# Altium schematic sheet APP_1_Ethernet_m.SchDoc
size Tabloid; SheetNumber: 11; SheetTotal: 16; Sheet_Name: Ethernet; Size: 11x17
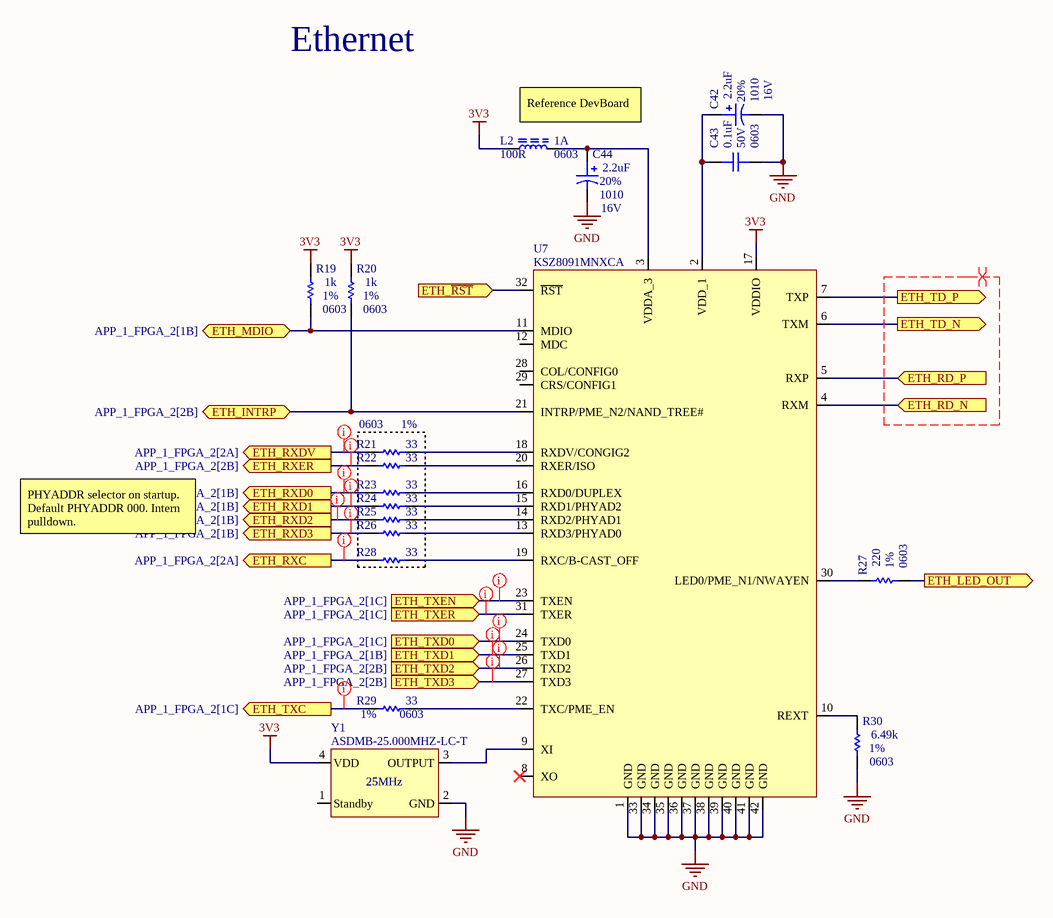
[diagram p0: APP_1_Ethernet_m.SchDoc]

## Parts
C42  value 2.2uF  Voltage: 16V  Package: 1010  Precision: 20%  [CAP_ALU_1010_vishay]  (hidden comment: MAL214699501E3)
C43  value 0.1uF  Voltage: 50V  Package: 0603  [CAP_0603]  (hidden comment: CAP - 0603)
C44  value 2.2uF  Voltage: 16V  Package: 1010  Precision: 20%  [CAP_ALU_1010_vishay]  (hidden comment: MAL214699501E3)
L2  value 100R  Current: 1A  Package: 0603  [FER_0603]  (hidden comment: FER - 0603)
R19  value 1k  Package: 0603  Precision: 1%  [RES_0603]  (hidden comment: RES - 0603)
R20  value 1k  Package: 0603  Precision: 1%  [RES_0603]  (hidden comment: RES - 0603)
R21  value 33  Package: 0603  Precision: 1%  [RES_0603]  (hidden comment: RES - 0603)
R22  value 33  [RES_0603]  (hidden comment: RES - 0603)
R23  value 33  [RES_0603]  (hidden comment: RES - 0603)
R24  value 33  [RES_0603]  (hidden comment: RES - 0603)
R25  value 33  [RES_0603]  (hidden comment: RES - 0603)
R26  value 33  [RES_0603]  (hidden comment: RES - 0603)
R27  value 220  Package: 0603  Precision: 1%  [RES_0603]  (hidden comment: RES - 0603)
R28  value 33  [RES_0603]  (hidden comment: RES - 0603)
R29  value 33  Package: 0603  Precision: 1%  [RES_0603]  (hidden comment: RES - 0603)
R30  value 6.49k  Package: 0603  Precision: 1%  [RES_0603]  (hidden comment: RES - 0603)
U7  KSZ8091MNXCA  [COM_ETH_PHY_KSZ8091MNXCA]
Y1  ASDMB-25.000MHZ-LC-T  [OSC_ASDMB-25.000MHZ-LC-T]

## Ports
ETH_INTRP (bidir, see APP_1_FPGA_2[2B]), ETH_LED_OUT (out), ETH_MDIO (bidir, see APP_1_FPGA_2[1B]), ETH_RD_N (in, see APP_1_Connectors_m[6B]), ETH_RD_P (in, see APP_1_Connectors_m[6B]), ETH_RXC (out, see APP_1_FPGA_2[2A]), ETH_RXD0 (out, see APP_1_FPGA_2[1B]), ETH_RXD1 (out, see APP_1_FPGA_2[1B]), ETH_RXD2 (out, see APP_1_FPGA_2[1B]), ETH_RXD3 (out, see APP_1_FPGA_2[1B]), ETH_RXDV (out, see APP_1_FPGA_2[2A]), ETH_RXER (out, see APP_1_FPGA_2[2B]), ETH_TD_N (out, see APP_1_Connectors_m[6B]), ETH_TD_P (out, see APP_1_Connectors_m[6B]), ETH_TXC (out, see APP_1_FPGA_2[1C]), ETH_TXD0 (in, see APP_1_FPGA_2[1C]), ETH_TXD1 (in, see APP_1_FPGA_2[1B]), ETH_TXD2 (in, see APP_1_FPGA_2[2B]), ETH_TXD3 (in, see APP_1_FPGA_2[2B]), ETH_TXEN (in, see APP_1_FPGA_2[1C]), ETH_TXER (in, see APP_1_FPGA_2[1C]), ETH_~{RST} (in)

## Nets
3V3: L2.2 R19.2 R20.2 U7.17(VDDIO) Y1.4(VDD)
GND: C42.2 C43.1 C44.2 R30.1 U7.1(GND) U7.33(GND) U7.34(GND) U7.35(GND) U7.36(GND) U7.37(GND) U7.38(GND) U7.39(GND) U7.40(GND) U7.41(GND) U7.42(GND) Y1.2(GND)
ETH_INTRP: R20.1 U7.21(INTRP/PME_N2/NAND_TREE#) ; port ETH_INTRP
ETH_LED_OUT: R27.1 ; port ETH_LED_OUT
ETH_MDIO: R19.1 U7.11(MDIO) ; port ETH_MDIO
ETH_~{RST}: U7.32(~{RST}) ; port ETH_~{RST}
ETH_RD_N: U7.4(RXM) ; port ETH_RD_N
ETH_RD_P: U7.5(RXP) ; port ETH_RD_P
ETH_RXC: R28.2 ; port ETH_RXC
ETH_RXD0: R23.2 ; port ETH_RXD0
ETH_RXD1: R24.2 ; port ETH_RXD1
ETH_RXD2: R25.2 ; port ETH_RXD2
ETH_RXD3: R26.2 ; port ETH_RXD3
ETH_RXDV: R21.2 ; port ETH_RXDV
ETH_RXER: R22.2 ; port ETH_RXER
ETH_TD_N: U7.6(TXM) ; port ETH_TD_N
ETH_TD_P: U7.7(TXP) ; port ETH_TD_P
ETH_TXC: R29.2 ; port ETH_TXC
ETH_TXD0: U7.24(TXD0) ; port ETH_TXD0
ETH_TXD1: U7.25(TXD1) ; port ETH_TXD1
ETH_TXD2: U7.26(TXD2) ; port ETH_TXD2
ETH_TXD3: U7.27(TXD3) ; port ETH_TXD3
ETH_TXEN: U7.23(TXEN) ; port ETH_TXEN
ETH_TXER: U7.31(TXER) ; port ETH_TXER
NetC42_1: C42.1 C43.2 U7.2(VDD_1)
NetC44_1: C44.1 L2.1 U7.3(VDDA_3)
NetR21_1: R21.1 U7.18(RXDV/CONGIG2)
NetR22_1: R22.1 U7.20(RXER/ISO)
NetR23_1: R23.1 U7.16(RXD0/DUPLEX)
NetR24_1: R24.1 U7.15(RXD1/PHYAD2)
NetR25_1: R25.1 U7.14(RXD2/PHYAD1)
NetR26_1: R26.1 U7.13(RXD3/PHYAD0)
NetR27_2: R27.2 U7.30(LED0/PME_N1/NWAYEN)
NetR28_1: R28.1 U7.19(RXC/B-CAST_OFF)
NetR29_1: R29.1 U7.22(TXC/PME_EN)
NetR30_2: R30.2 U7.10(REXT)
NetU7_9: U7.9(XI) Y1.3(OUTPUT)

Not connected (* = marked no-connect by the designer): U7 8(XO)* 12(MDC) 28(COL/CONFIG0) 29(CRS/CONFIG1); Y1 1(Standby)

## Layout directives
differential pair: (no net found under the mark)
net class ETH_RX: ETH_RXC, ETH_RXD0, ETH_RXD1, ETH_RXD2, ETH_RXD3, ETH_RXDV, ETH_RXER
net class ETH_TX: ETH_TXC, ETH_TXD0, ETH_TXD1, ETH_TXD2, ETH_TXD3, ETH_TXEN, ETH_TXER

## Notes on the sheet
- Ethernet
- Reference DevBoard
- PHYADDR selector on startup. Default PHYADDR 000. Intern pulldown.
- Sheet Name
- Project Title
- Global Project
- Size
- Group
- Revision
- Date
- Sheet
- of
- Filename
- Designers

## Library data of the parts
C42 C44 = CAP_ALU_MAL214699501E3: CAP - ALU 330uF 20% 16V - 1010; Current: 750mA; Mfg: Vishay Dale; Mfg Part Number: MAL214699501E3; HelpURL: http://www.vishay.com/docs/28403/146cti.pdf; CreatedBy: Jonathan Bouchard; Temperature: -55°C to 125°C; Power: *; Supplier 1: Digikey; Supplier Part Number 1: 4405PHCT-ND
C43 = CAP - 0603: Precision: 10%; Current: *; CreatedBy: Jonathan Bouchard; Power: *
R22-R26 R28 = RES - 0603: Precision: 1%; Current: *; CreatedBy: Jonathan Bouchard; Package: 0603
U7 = COM_ETH_PHY_KSZ8091MNXCA: COM - ETHERNET PHY 10/100 - QFN-32; Voltage: 1.8V, 2.5V, 3.3V; Mfg: Micrel; Current: *; Power: *; Mfg Part Number: KSZ8091MNXCA; HelpURL: http://ww1.microchip.com/downloads/en/DeviceDoc/00002275A.pdf; CreatedBy: Jonathan Bouchard; Temperature: 0°C ~ 70°C; Value: *; Precision: *; Package: QFN-32; Supplier 1: Digikey; Supplier Part Number 1: 576-4356-ND
Y1 = OSC_ASDMB-25.000MHZ-LC-T: OSC - 25MHz XO (Standard) LVCMOS - 4-SMD, No Lead; Manufacturer #1: Abracon LLC; Tolerance: ±50ppm; Voltage Rating: 1.8V ~ 3.3V; GRAMS Lib Spec: 2.8; Magnetic Material: Unknown; Polarized: Yes; Value: 25MHz; Current Rating: *; Power Max: *; HelpURL: https://abracon.com/Oscillators/ASDMB.pdf; CreatedBy/Date: Joël Lemay 2019-03-29; VerifiedBy: C. Paulin - 29 mai 2019; Temperature: -40°C ~ +85°C; Package: 4-SMD, No Lead; Manufacturer #2: *; Note: *; Assembly Type: SMD; Part Number #2: *; Part Number #1: ASDMB-25.000MHZ-LC-T; Supplier 1: Digi-Key; Supplier Part Number 1: 535-11730-1-ND; Cryo: UNKNOWN
L2 = FER - 0603: Voltage: *; CreatedBy: Jonathan Bouchard; Power: *; Precision: *
R19-R21 R27 R29 R30 = RES - 0603: Current: *; CreatedBy: Jonathan Bouchard